# EAGLE design Capstone V4 (EAGLE 9.6.2)
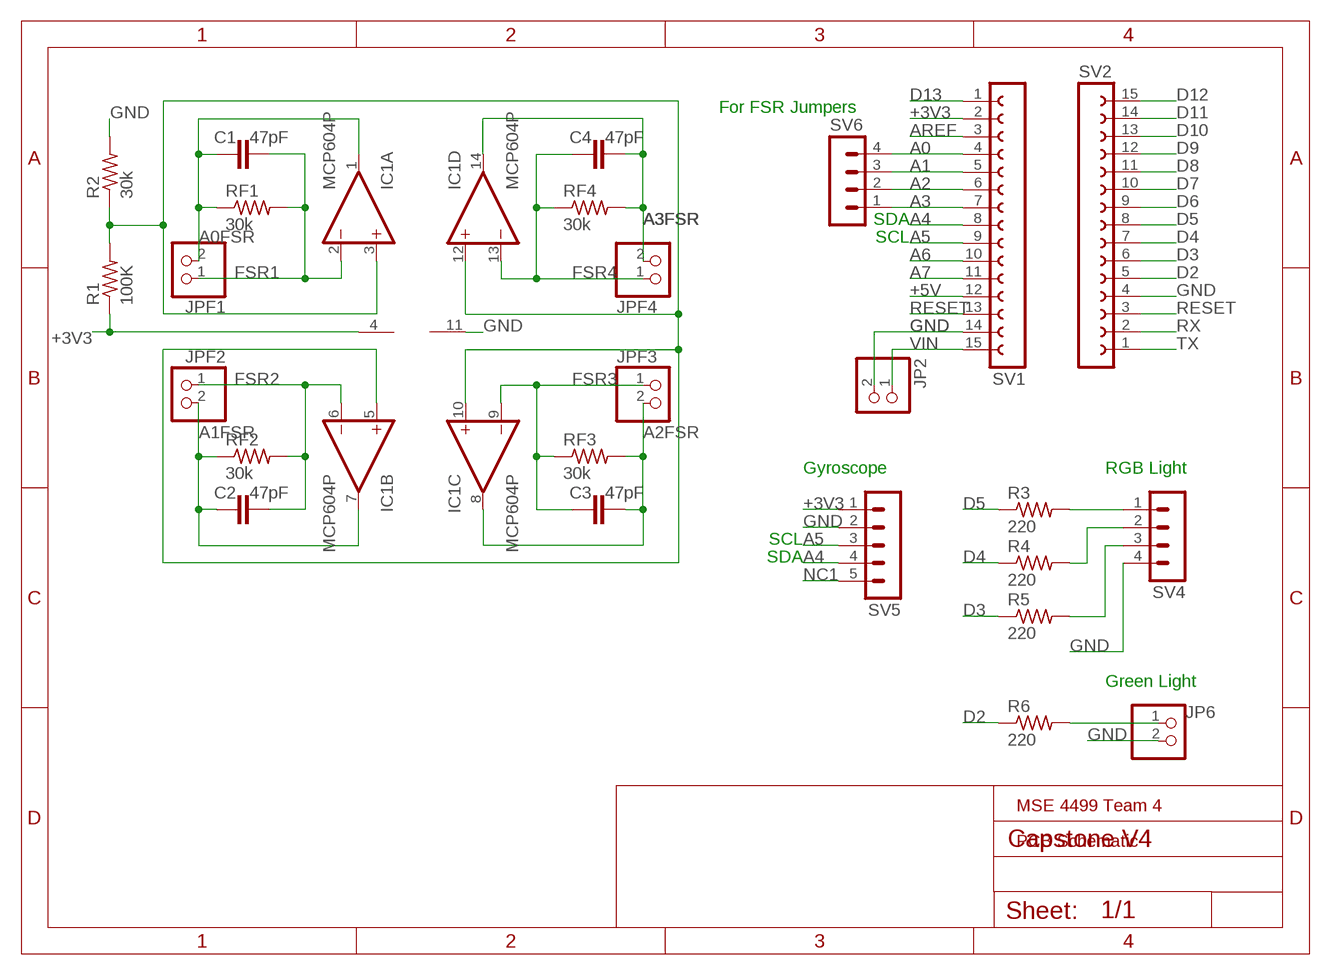
[diagram p0: schematic, sheet 1]

## Parts
C1  47pF  C2,5-3  [C2.5-3]
C2  47pF  C2,5-3  [C2.5-3]
C3  47pF  C2,5-3  [C2.5-3]
C4  47pF  C2,5-3  [C2.5-3]
IC1  MCP604P  [DIL14]
JP2  PINHD-1X2  [1X02]
JP6  PINHD-1X2  [1X02]
JPF1  PINHD-1X2  [1X02]
JPF2  PINHD-1X2  [1X02]
JPF3  PINHD-1X2  [1X02]
JPF4  PINHD-1X2  [1X02]
R1  100K  R-US_0204/7  [0204/7]
R2  30k  R-US_0204/7  [0204/7]
R3  220  R-US_0204/7  [0204/7]
R4  220  R-US_0204/7  [0204/7]
R5  220  R-US_0204/7  [0204/7]
R6  220  R-US_0204/7  [0204/7]
RF1  30k  R-US_0204/7  [0204/7]
RF2  30k  R-US_0204/7  [0204/7]
RF3  30k  R-US_0204/7  [0204/7]
RF4  30k  R-US_0204/7  [0204/7]
SV1  FE15-1  [FE15]
SV2  FE15-1  [FE15]
SV4  MA04-1  [MA04-1]
SV5  MA05-1  [MA05-1]
SV6  MA04-1  [MA04-1]

## Nets
+3V3: IC1.4(P:V+) R1.1 SV1.2 SV5.1
+5V: SV1.12
A0: SV1.4 SV6.4
A0FSR: C1.1 IC1.1(A:OUT) JPF1.2 RF1.1
A1: SV1.5 SV6.3
A1FSR: C2.1 IC1.7(B:OUT) JPF2.2 RF2.1
A2: SV1.6 SV6.2
A2FSR: C3.2 IC1.8(C:OUT) JPF3.2 RF3.2
A3: SV1.7 SV6.1
A3FSR: C4.2 IC1.14(D:OUT) JPF4.2 RF4.2
A4: SV1.8 SV5.4
A5: SV1.9 SV5.3
A6: SV1.10
A7: SV1.11
AREF: SV1.3
D2: R6.1 SV2.5
D3: R5.1 SV2.6
D4: R4.1 SV2.7
D5: R3.1 SV2.8
D6: SV2.9
D7: SV2.10
D8: SV2.11
D9: SV2.12
D10: SV2.13
D11: SV2.14
D12: SV2.15
D13: SV1.1
FSR1: C1.2 IC1.2(A:-IN) JPF1.1 RF1.2
FSR2: C2.2 IC1.6(B:-IN) JPF2.1 RF2.2
FSR3: C3.1 IC1.9(C:-IN) JPF3.1 RF3.1
FSR4: C4.1 IC1.13(D:-IN) JPF4.1 RF4.1
GND: IC1.11(P:V-) JP2.2 JP6.2 R2.2 SV1.14 SV2.4 SV4.4 SV5.2
N$1: R3.2 SV4.1
N$3: R4.2 SV4.2
N$5: R5.2 SV4.3
N$8: JP6.1 R6.2
N$10: IC1.3(A:+IN) IC1.5(B:+IN) IC1.10(C:+IN) IC1.12(D:+IN) R1.2 R2.1
NC1: SV5.5
RESET: SV1.13 SV2.3
RX: SV2.2
TX: SV2.1
VIN: JP2.1 SV1.15

## Notes on the sheet
- For FSR Jumpers
- SDA
- SCL
- Gyroscope | RGB Light
- SCL
- SDA
- Green Light
- MSE 4499 Team 4
- PCB Schematic

## Library data of the parts
C1-C4 = capacitor-wima:C: CAPACITOR naming: grid - package width
IC1 = linear:MCP604: Quad Op Amp 2.7V to 6.0V Single Supply CMOS Source: http://ww1.microchip.com/downloads/en/DeviceDoc/21314g.pdf
JP2 JP6 JPF1-JPF4 = pinhead:PINHD-1X2: PIN HEADER
R1-R6 RF1-RF4 = resistor:R-US_: RESISTOR, American symbol
SV1 SV2 = con-lsta:FE15-1: FEMALE HEADER; OC_FARNELL: unknown; OC_NEWARK: unknown
SV4 SV6 = con-lstb:MA04-1: PIN HEADER; OC_FARNELL: unknown; OC_NEWARK: unknown
SV5 = con-lstb:MA05-1: PIN HEADER; OC_FARNELL: unknown; OC_NEWARK: unknown

## Net classes
0 default: width 0.19 mm, drill 0.19 mm

## Board
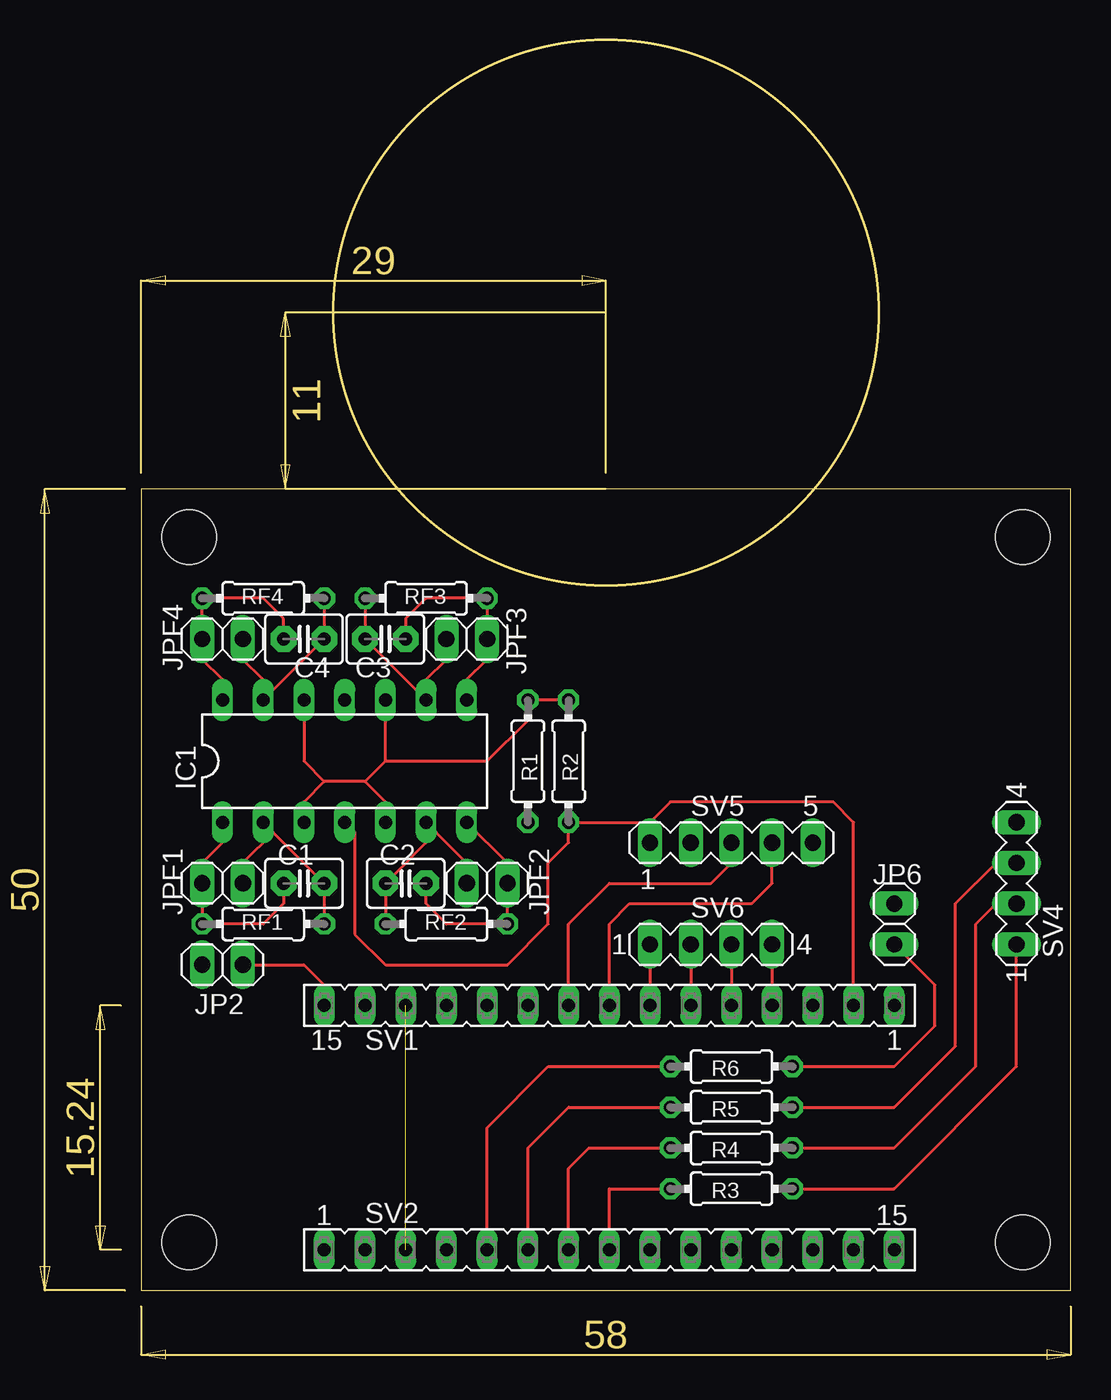
[diagram p1: board, top side]
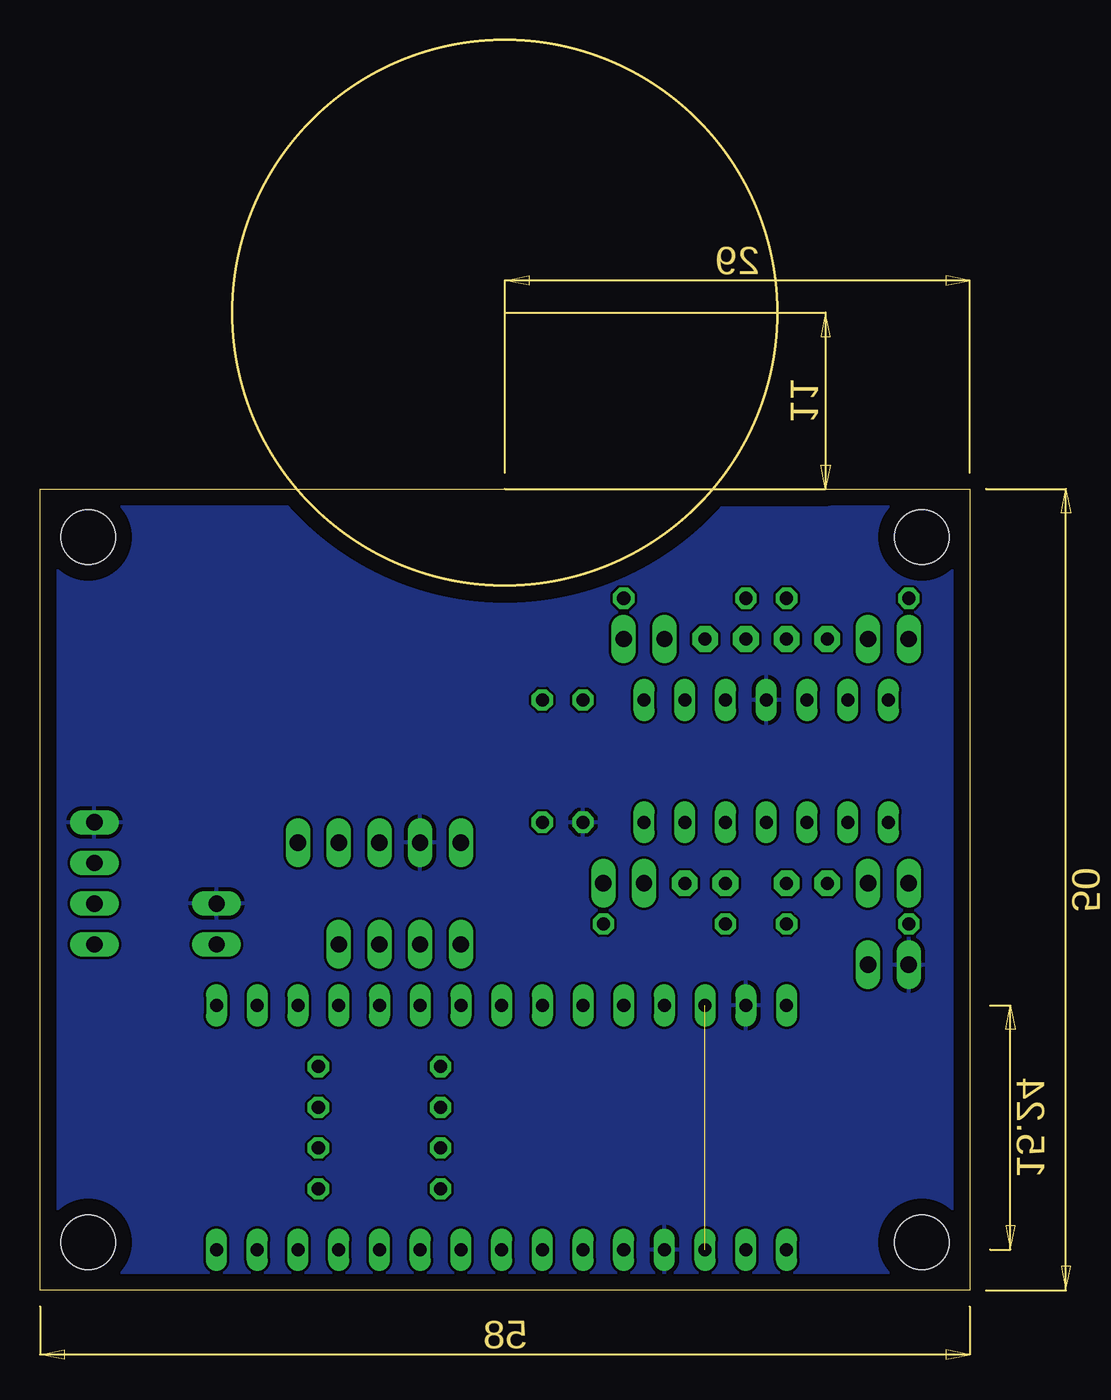
[diagram p2: board, bottom side, seen from below]

Size 58 x 78 mm. Coordinates in mm from the lower left corner, seen from the top.
Outline: 0,0 58,0 58,50 0,50 0,0
Outline: circle at 29,61 radius 17
Copper layers (1*16): Top 0.035mm / dielectric 1.5mm / Bottom 0.035mm
Design rules "default": minimum track width 6mil, minimum drill 0.35mm, track to track 6mil, track to pad 6mil, pad to pad 6mil, via to via 6mil, smd to smd 6mil, copper to edge 40mil, drill to drill 6mil, minimum pad ring 10mil, minimum via ring 8mil, stop-mask expansion 4mil, vias tented up to drill 0mil, thermal gap 10mil
Holes 3.4 mm at 3,3 55,3 55,47 3,47
Holes 34 mm at 29,61

### Footprints (pad centres in the part's own frame; a part is rotated, then mirrored left to right if it is on the bottom)
C2.5-3 = drill 0.813 pad 1.6 octagon: 1 -1.27,0; 2 1.27,0
DIL14 = drill 0.813 long: 1 -7.62,-3.81; 2 -5.08,-3.81; 3 -2.54,-3.81; 4 0,-3.81; 5 2.54,-3.81; 6 5.08,-3.81; 7 7.62,-3.81; 8 7.62,3.81; 9 5.08,3.81; 10 2.54,3.81; 11 0,3.81; 12 -2.54,3.81; 13 -5.08,3.81; 14 -7.62,3.81
1X02 = drill 1.016 long: 1 -1.27,0; 2 1.27,0
0204/7 = drill 0.813 octagon: 1 -3.81,0; 2 3.81,0
FE15 = drill 0.813 long: 1 -17.78,0; 2 -15.24,0; 3 -12.7,0; 4 -10.16,0; 5 -7.62,0; 6 -5.08,0; 7 -2.54,0; 8 0,0; 9 2.54,0; 10 5.08,0; 11 7.62,0; 12 10.16,0; 13 12.7,0; 14 15.24,0; 15 17.78,0
MA04-1 = drill 1.016 long: 1 -3.81,0; 2 -1.27,0; 3 1.27,0; 4 3.81,0
MA05-1 = drill 1.016 long: 1 -5.08,0; 2 -2.54,0; 3 0,0; 4 2.54,0; 5 5.08,0

### Placement (x,y rotation side)
C1  10.16,25.4 0 top
C2  16.51,25.4 180 top
C3  15.24,40.64 0 top
C4  10.16,40.64 180 top
IC1  12.7,33.02 0 top
JP2  5.08,20.32 180 top
JP6  46.99,22.86 90 top
JPF1  5.08,25.4 180 top
JPF2  21.59,25.4 0 top
JPF3  20.32,40.64 0 top
JPF4  5.08,40.64 180 top
R1  26.67,33.02 90 top
R2  24.13,33.02 270 top
R3  36.83,6.35 0 top
R4  36.83,8.89 0 top
R5  36.83,11.43 0 top
R6  36.83,13.97 0 top
RF1  7.62,22.86 0 top
RF2  19.05,22.86 180 top
RF3  17.78,43.18 0 top
RF4  7.62,43.18 180 top
SV1  29.21,17.78 180 top
SV2  29.21,2.54 0 top
SV4  54.61,25.4 90 top
SV5  36.83,27.94 0 top
SV6  35.56,21.59 0 top

### Tracks (layer width: path | path; a pad name or v marks a point on that pad's centre or on a via)
+3V3
  Top 0.19: IC1.4 13.34,28.57 13.34,22.23 15.24,20.32 22.86,20.32 25.4,22.86 25.4,26.67 26.67,27.94 R1.1 31.75,29.21 | SV1.2 44.45,29.21 43.18,30.48 33.02,30.48 31.75,29.21 | 31.75,29.21 SV5.1
A0
  Top 0.19: SV6.4 SV1.4
A0FSR
  Top 0.19: C1.1 8.89,24.13 7.62,22.86 RF1.1 JPF1.2 3.81,26.67 5.08,27.94 IC1.1
A1
  Top 0.19: SV6.3 SV1.5
A1FSR
  Top 0.19: C2.1 17.78,24.13 19.05,22.86 RF2.1 JPF2.2 22.86,26.67 IC1.7
A2
  Top 0.19: SV6.2 SV1.6
A2FSR
  Top 0.19: C3.2 16.51,41.91 17.78,43.18 RF3.2 JPF3.2 21.59,39.37 20.32,38.1 IC1.8
A3
  Top 0.19: SV6.1 SV1.7
A3FSR
  Top 0.19: C4.2 8.89,41.91 7.62,43.18 RF4.2 JPF4.2 3.81,39.37 5.08,38.1 IC1.14
A4
  Top 0.19: SV1.8 29.21,22.86 30.48,24.13 38.1,24.13 39.37,25.4 SV5.4
A5
  Top 0.19: SV1.9 26.67,22.86 29.21,25.4 35.56,25.4 36.83,26.67 SV5.3
D2
  Top 0.19: SV2.5 21.59,10.16 25.4,13.97 R6.1
D3
  Top 0.19: SV2.6 24.13,8.89 26.67,11.43 R5.1
D4
  Top 0.19: SV2.7 26.67,7.62 27.94,8.89 R4.1
D5
  Top 0.19: SV2.8 29.21,6.35 R3.1
FSR1
  Top 0.19: RF1.2 C1.2 IC1.2 8.26,28.57 6.35,26.67 JPF1.1
FSR2
  Top 0.19: RF2.2 C2.2 18.41,28.57 IC1.6 20.32,26.67 JPF2.1
FSR3
  Top 0.19: RF3.1 C3.1 IC1.9 17.78,38.1 19.05,39.37 JPF3.1
FSR4
  Top 0.19: RF4.1 C4.1 IC1.13 7.62,38.1 6.35,39.37 JPF4.1
GND
  pour Bottom: 0,0 58,0 58,50 0,50
N$1
  Top 0.19: R3.2 46.99,6.35 54.61,13.97 SV4.1
N$3
  Top 0.19: R4.2 46.99,8.89 52.07,13.97 52.07,22.86 53.34,24.13 SV4.2
N$5
  Top 0.19: R5.2 46.99,11.43 50.8,15.24 50.8,24.13 53.34,26.67 SV4.3
N$8
  Top 0.19: R6.2 46.99,13.97 49.53,16.51 49.53,19.05 JP6.1
N$10
  Top 0.19: IC1.5 15.24,30.48 13.97,31.75 | 13.97,31.75 11.43,31.75 | 11.43,31.75 10.16,30.48 IC1.3 | IC1.12 10.16,33.02 11.43,31.75 | 13.97,31.75 15.24,33.02 | 15.24,33.02 IC1.10 | R1.2 R2.1 24.13,35.56 21.59,33.02 15.24,33.02
RESET  (1 unrouted)
VIN
  Top 0.19: JP2.1 10.16,20.32 11.43,19.05 SV1.15